# EAGLE design SPF (EAGLE 6.5.0)
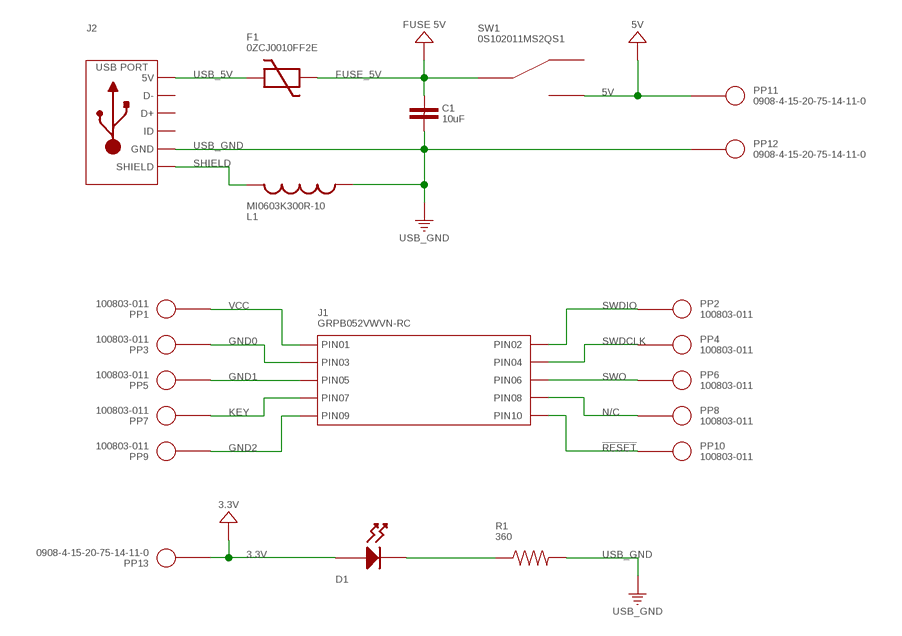
[diagram p0: schematic, sheet 1]

## Parts
C1  10uF  CAPACITOR_NON_POLAR_1206  [1206]
D1  LED_SINGLE_0805  [LED0805]
F1  0ZCJ0010FF2E  PTC_FUSE_1206  [1206]
J1  GRPB052VWVN-RC  CON_02X05_GRPB052VWVN-RC  [GRPB052VWVN-RC]
J2  USB_MICRO_RIGHT  [MICROUSB-RIGHT]
L1  MI0603K300R-10  INDUCTOR_0603  [0603]
PP1  100803-011  POGO_PIN_100803_PROBE  [100803_PROBE]
PP2  100803-011  POGO_PIN_100803_PROBE  [100803_PROBE]
PP3  100803-011  POGO_PIN_100803_PROBE  [100803_PROBE]
PP4  100803-011  POGO_PIN_100803_PROBE  [100803_PROBE]
PP5  100803-011  POGO_PIN_100803_PROBE  [100803_PROBE]
PP6  100803-011  POGO_PIN_100803_PROBE  [100803_PROBE]
PP7  100803-011  POGO_PIN_100803_PROBE  [100803_PROBE]
PP8  100803-011  POGO_PIN_100803_PROBE  [100803_PROBE]
PP9  100803-011  POGO_PIN_100803_PROBE  [100803_PROBE]
PP10  100803-011  POGO_PIN_100803_PROBE  [100803_PROBE]
PP11  0908-4-15-20-75-14-11-0  POGO_PIN_0908-4-15-20-75-14-11-0  [0908-4-15-20-75-14-11-0]
PP12  0908-4-15-20-75-14-11-0  POGO_PIN_0908-4-15-20-75-14-11-0  [0908-4-15-20-75-14-11-0]
PP13  0908-4-15-20-75-14-11-0  POGO_PIN_0908-4-15-20-75-14-11-0  [0908-4-15-20-75-14-11-0]
R1  360  RESISTOR_0805  [0805]
SW1  0S102011MS2QS1  SPDT_0S102011MS2QS1  [0S102011MS2QS1]

## Nets
3.3V: D1.ANODE PP13.P$1
5V: PP11.P$1 SW1.3
!RESET: J1.10(PIN10) PP10.P$1
FUSE_5V: C1.1 F1.2 SW1.2(C) ; supply symbol labelled FUSE 5V
GND0: J1.3(PIN3) PP3.P$1
GND1: J1.5(PIN5) PP5.P$1
GND2: J1.9(PIN9) PP9.P$1
KEY: J1.7(PIN7) PP7.P$1
N$1: D1.CATHODE R1.1
N/C: J1.8(PIN8) PP8.P$1
SHIELD: J2.S1(SLD) J2.S2(SLD) J2.S3(SLD) J2.S4(SLD) J2.S5(SLD) J2.S6(SLD) L1.1
SWDCLK: J1.4(PIN4) PP4.P$1
SWDIO: J1.2(PIN2) PP2.P$1
SWO: J1.6(PIN6) PP6.P$1
USB_5V: F1.1 J2.1(5V)
USB_GND: C1.2 J2.5(GND) L1.2 PP12.P$1 R1.2
VCC: J1.1(PIN1) PP1.P$1
Unconnected: J2.2(D-) J2.3(D+) J2.4(ID) SW1.1

## Library data of the parts
C1 = PP_Passives:CAPACITOR_NON_POLAR: Capacitor Non Polarized
D1 = MF_LEDs:LED_SINGLE: Library: MF_LEDs Description: Device for Single LED Packages. Manufacture part number (MFG#) can be added via Attributes.
F1 = PP_Passives:PTC_FUSE
J1 = PP_Connectors:CON_02X05; LABEL01: VCC; LABEL02: SWDIO; LABEL03: GND; LABEL04: SWDCLK; LABEL05: GND; LABEL06: SWO; LABEL09: GND; LABEL10: !RESET
J2 = MF_Connectors:USB: Library: MF_Connectors Description: 5 Pin USB Connectors. SLD is the shield connection. Usually tied to ground through a small ferrite bead.
L1 = PP_Passives:INDUCTOR: Inductors
PP1-PP13 = PP_Connectors:POGO_PIN
R1 = PP_Passives:RESISTOR: Resistors
SW1 = PP_Electromechanical:SPDT

## Board
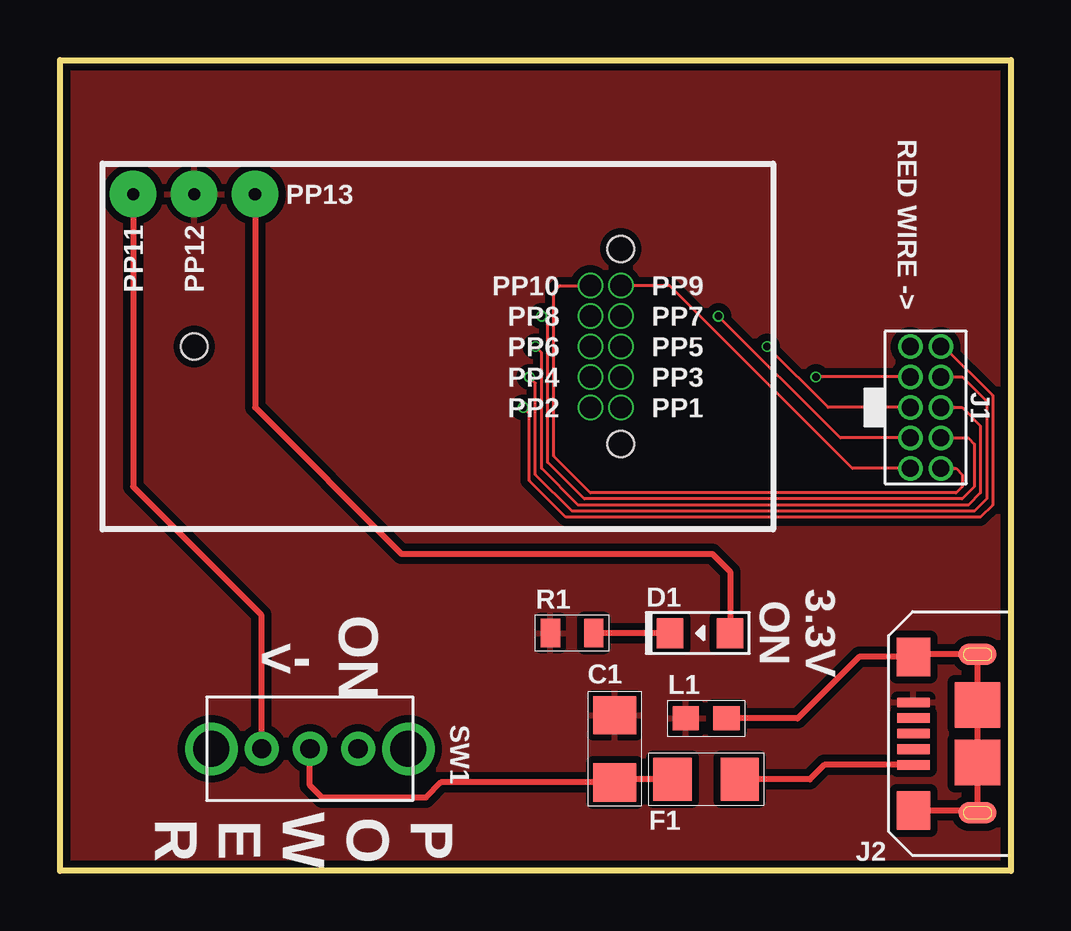
[diagram p1: board, top side]
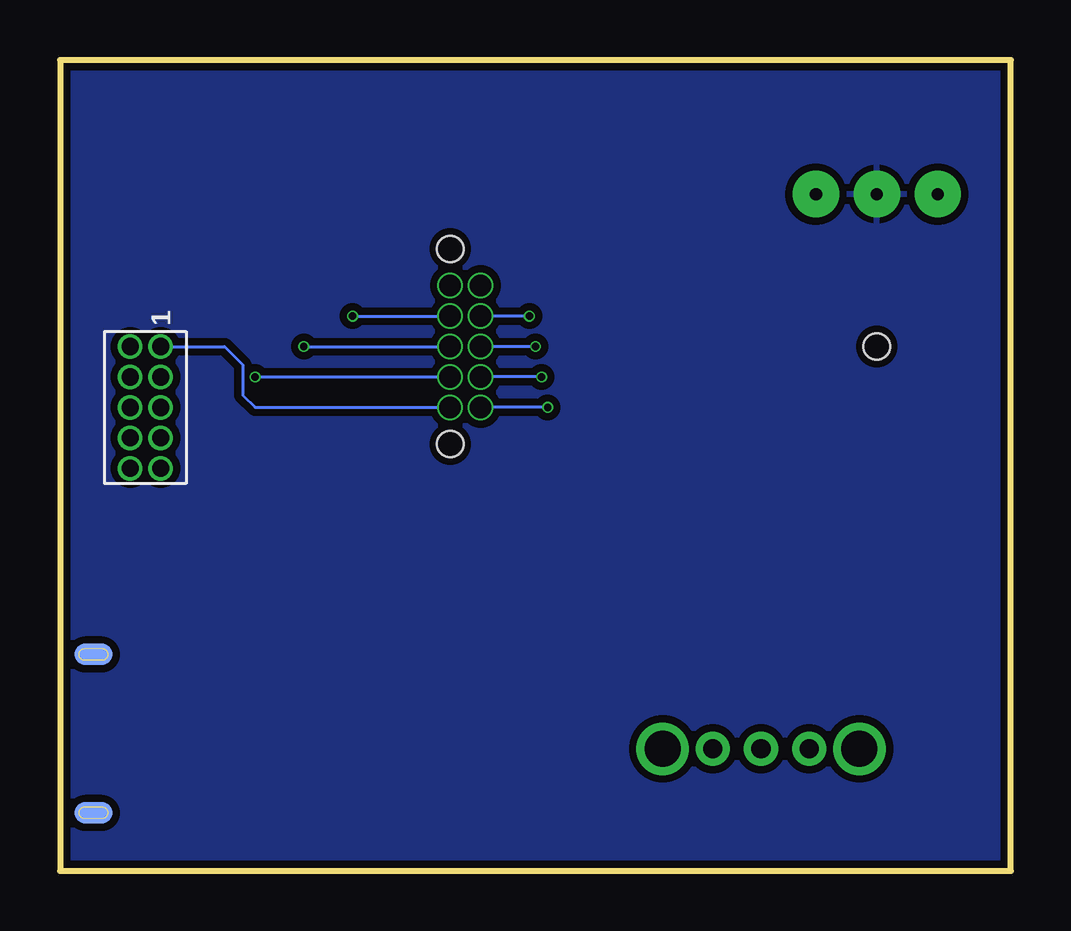
[diagram p2: board, bottom side, seen from below]

Size 39.62 x 33.78 mm. Coordinates in mm from the lower left corner, seen from the top.
Outline: 0,0 0,33.78 39.62,33.78 39.62,0 0,0
Copper layers (1*16): Top 0.035mm / dielectric 1.5mm / Bottom 0.035mm
Design rules "MF_Standard_2_Layer *": minimum track width 5mil, minimum drill 12mil, track to track 5mil, track to pad 5mil, pad to pad 5mil, via to via 5mil, smd to smd 0mil, copper to edge 10mil, drill to drill 10mil, minimum pad ring 1mil, minimum via ring 3mil, stop-mask expansion 2mil, vias tented up to drill 25mil, thermal gap 10mil
Holes 1.1 mm at 23.37,25.91 23.37,17.78 5.59,21.84

### Footprints (pad centres in the part's own frame; a part is rotated, then mirrored left to right if it is on the bottom)
1206 = smd 1.6 x 1.8: 1 -1.4,0; 2 1.4,0
LED0805 = smd 1.1 x 1.25: ANODE 1.25,0; CATHODE -1.25,0
GRPB052VWVN-RC = drill 0.711 pad 1.016: 1 -2.54,0.635; 2 -2.54,-0.635; 3 -1.27,0.635; 4 -1.27,-0.635; 5 0,0.635; 6 0,-0.635; 7 1.27,0.635; 8 1.27,-0.635; 9 2.54,0.635; 10 2.54,-0.635
MICROUSB-RIGHT = smd 0.4 x 1.35: 1 -1.3,1.27; 2 -0.65,1.27; 3 0,1.27; 4 0.65,1.27; 5 1.3,1.27 | smd 0.9 x 1.6: S1 -3.3,-1.4; S2 3.3,-1.4 | smd 1.6 x 1.4: S3 -3.2,1.27; S4 3.2,1.27 | smd 1.9 x 1.9: S5 -1.2,-1.405; S6 1.2,-1.405 | smd 0.9 x 1.6 bottom: S7 -3.3,-1.4; S8 3.3,-1.4
0603 = smd 1.1 x 1: 1 -0.85,0; 2 0.85,0
100803_PROBE = drill 0.9 pad 1.067: P$1 0,0
0908-4-15-20-75-14-11-0 = drill 0.508 pad 1.93: P$1 0,0
0805 = smd 0.8 x 1.2: 1 -0.9,0; 2 0.9,0
0S102011MS2QS1 = drill 0.8 pad 1.422: 1 -2.007,0; 2 0,0; 3 2.007,0 | drill 1.5 pad 2.184: P$4 -4.102,0; P$5 4.102,0

### Placement (x,y rotation side)
C1  23.11,5.08 90 top
D1  26.67,9.91 0 top
F1  26.92,3.81 180 top
J1  36.07,19.3 270 bottom
J2  36.83,5.71 90 top
L1  26.92,6.35 180 top
PP1  23.37,19.3 90 top
PP2  22.1,19.3 270 top
PP3  23.37,20.57 90 top
PP4  22.1,20.57 270 top
PP5  23.37,21.84 90 top
PP6  22.1,21.84 270 top
PP7  23.37,23.11 90 top
PP8  22.1,23.11 270 top
PP9  23.37,24.38 90 top
PP10  22.1,24.38 270 top
PP11  3.05,28.19 270 top
PP12  5.59,28.19 270 top
PP13  8.13,28.19 0 top
R1  21.34,9.91 180 top
SW1  10.41,5.08 180 top

### Tracks (layer width: path | path; a pad name or v marks a point on that pad's centre or on a via)
3.3V
  Top 0.254: PP13.P$1 8.13,19.3 14.22,13.21 27.18,13.21 27.92,12.47 D1.ANODE
5V
  Top 0.254: PP11.P$1 3.05,16 8.38,10.67 8.38,5.11 SW1.3
!RESET
  Top 0.127: J1.10 37.34,16.76 37.59,16.51 37.59,16 37.34,15.75 22.1,15.75 20.57,17.27 20.57,24.13 20.83,24.38 PP10.P$1
FUSE_5V
  Top 0.254: F1.2 23.24,3.81 C1.1 15.87,3.68 15.24,3.05 10.92,3.05 10.41,3.56 SW1.2
GND0  (via drill 0.3)
  Top 0.127: J1.3 v31.5,20.57
  Bottom 0.127: v31.5,20.57 PP3.P$1
GND1  (via drill 0.3)
  Top 0.127: J1.5 32,19.3 v29.46,21.84
  Bottom 0.127: v29.46,21.84 PP5.P$1
GND2
  Top 0.127: J1.9 33.02,16.76 25.4,24.38 PP9.P$1
KEY  (via drill 0.3)
  Top 0.127: J1.7 32.51,18.03 v27.43,23.11
  Bottom 0.127: v27.43,23.11 PP7.P$1
N$1
  Top 0.254: D1.CATHODE R1.1
N/C  (via drill 0.3)
  Top 0.127: J1.8 37.85,18.03 38.1,17.78 38.1,16 37.59,15.49 21.84,15.49 20.32,17.02 20.32,22.86 v20.07,23.11
  Bottom 0.127: v20.07,23.11 PP8.P$1
SHIELD
  Top 0.254: J2.S3 38.13,2.52 J2.S1 J2.S5 J2.S6 J2.S2 35.66,9.02 J2.S4 33.3,8.91 30.73,6.35 L1.1
SWDCLK  (via drill 0.3)
  Top 0.127: J1.4 37.59,20.57 38.61,19.56 38.61,15.49 38.1,14.99 21.34,14.99 19.81,16.51 19.81,20.32 v19.56,20.57
  Bottom 0.127: v19.56,20.57 PP4.P$1
SWDIO  (via drill 0.3)
  Top 0.127: J1.2 36.83,21.84 38.86,19.81 38.86,15.24 38.35,14.73 21.08,14.73 19.56,16.26 19.56,19.05 v19.3,19.3
  Bottom 0.127: v19.3,19.3 PP2.P$1
SWO  (via drill 0.3)
  Top 0.127: J1.6 37.59,19.3 38.35,18.54 38.35,15.75 37.85,15.24 21.59,15.24 20.07,16.76 20.07,21.59 v19.81,21.84
  Bottom 0.127: v19.81,21.84 PP6.P$1
USB_5V
  Top 0.254: J2.1 31.85,4.42 31.24,3.81 F1.1
USB_GND
  pour Bottom (isolate 0.305): 0,33.78 0,0 39.62,0 39.62,33.78
  pour Top (isolate 0.305): 0,33.78 0,0 39.62,0 39.62,33.78
VCC
  Bottom 0.127: J1.1 32.77,21.84 32,21.08 32,19.81 31.5,19.3 PP1.P$1

### Text on the board
tPlace: RED WIRE -> | 3.3V / ON | <- | ON | P / O / W / E / R